# EAGLE design DriverBoard (EAGLE 9.6.2)
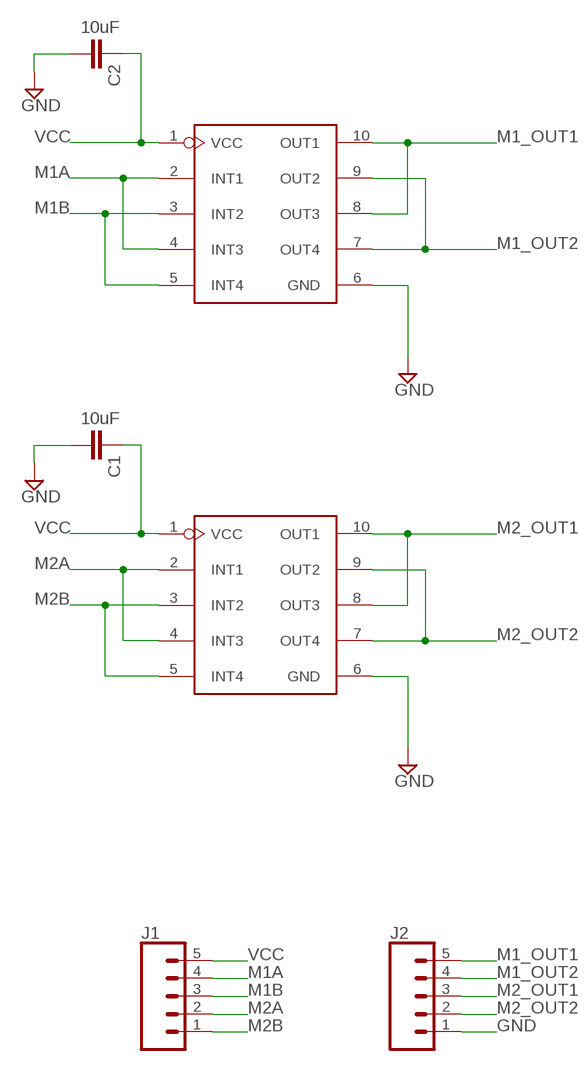
[diagram p0: schematic, sheet 1]

## Parts
C1  10uF  C-EUC0805  [C0805]
C2  10uF  C-EUC0805  [C0805]
J1  CONN_05  [1X05]
J2  CONN_05  [1X05]
U1  DRIVER-LV8548MC-AH(SOIC10)  [SOIC10-1.0-5X4MM]
U2  DRIVER-LV8548MC-AH(SOIC10)  [SOIC10-1.0-5X4MM]

## Nets
GND: C1.2 C2.2 J2.1 U1.6(GND) U2.6(GND)
M1_OUT1 [Out]: J2.5 U2.8(OUT3) U2.10(OUT1)
M1_OUT2 [Out]: J2.4 U2.7(OUT4) U2.9(OUT2)
M1A: J1.4 U2.2(INT1) U2.4(INT3)
M1B: J1.3 U2.3(INT2) U2.5(INT4)
M2_OUT1 [Out]: J2.3 U1.8(OUT3) U1.10(OUT1)
M2_OUT2 [Out]: J2.2 U1.7(OUT4) U1.9(OUT2)
M2A: J1.2 U1.2(INT1) U1.4(INT3)
M2B: J1.1 U1.3(INT2) U1.5(INT4)
VCC [Power]: C1.1 C2.1 J1.5 U1.1(VCC) U2.1(VCC)

## Library data of the parts
C1 C2 = rcl:C-EU: CAPACITOR, European symbol; SPICEPREFIX: C
J1 J2 = SparkFun-Connectors:CONN_05: Multi connection point. Often used as Generic Header-pin footprint for 0.1 inch spaced/style header connections On any of the 0.1 inch spaced packages, you can populate with these: Break Away Headers - Straight <https://www.sparkfun.com/products/116> (PRT-00116) Break Away Male Headers - Right Angle <https://www.sparkfun.com/products/553> (PRT-00553) Female Headers <https://www.sparkfun.com/products/115> (PRT-00115) Break Away Headers - Machine Pin <https://www.sparkfun.com/products/117> (PRT-00117) Break Away Female Headers - Swiss Machine Pin <https://www.sparkfun.com/products/743> (PRT-00743) For SCREWTERMINALS and SPRING TERMINALS visit here: Screw Terimnals on SparkFun.com <https://www.sparkfun.com/search/results?term=Screw+Terminals> (5mm/3.5mm/2.54mm spacing) This device is also useful as a general connection point to wire up your design to another part of your project. Our various solder wires solder well into these plated through hole pads. Hook-Up Wire - Assortment (Stranded, 22 AWG) <https://www.sparkfun.com/products/11375> (PRT-11375) Hook-Up Wire - Assortment (Solid Core, 22 AWG) <https://www.sparkfun.com/products/11367> (PRT-11367) View the entire wire category on our website here <https://www.sparkfun.com/categories/141> Special notes: Molex polarized connector foot print use with SKU : PRT-08231 with associated crimp pins and housings. 1MM SMD Version SKU: PRT-10208
U1 U2 = DRIVER-LV8548MC-AH_SOIC10_:DRIVER-LV8548MC-AH(SOIC10): 310030259 Check prices <https://pricing.snapeda.com/parts/LV8548MC-AH/ON%20Semiconductor/view-part?ref=eda>; AVAILABILITY: Warning; DESCRIPTION: Half Bridge (4) Driver DC Motors, General Purpose, Stepper Motors DMOS 10-SOIC; MF: ON Semiconductor; MP: LV8548MC-AH; PACKAGE: SOIC NB-10 ON Semiconductor; PRICE: None; PURCHASE-URL: https://pricing.snapeda.com/search/part/LV8548MC-AH/?ref=eda

## Net classes
0 default: width 0.254 mm, drill 0.3 mm, clearance 0.15 mm
1 Power: width 0.635 mm, drill 0.3 mm, clearance 0.2 mm
2 Out: width 0.508 mm, drill 0.3 mm, clearance 0.15 mm

## Board
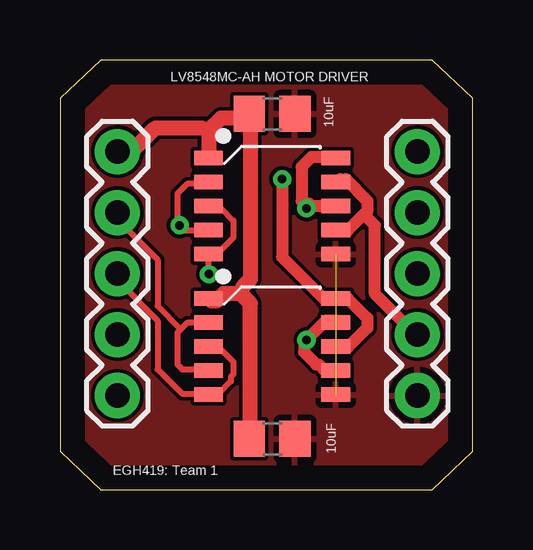
[diagram p1: board, top side]
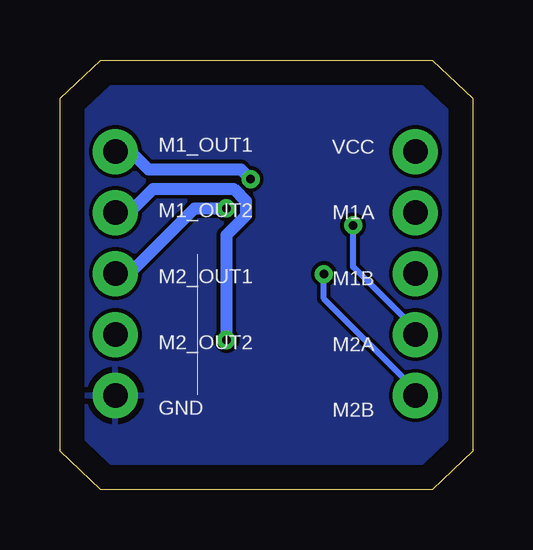
[diagram p2: board, bottom side, seen from below]

Size 17.2 x 17.9 mm. Coordinates in mm from the lower left corner, seen from the top.
Outline: 0,16.3 0,1.6 1.7,0 15.5,0 17.2,1.6 17.2,16.3 15.5,17.9 1.7,17.9 0,16.3
Copper layers (1*16): Top 0.035mm / dielectric 1.5mm / Bottom 0.035mm
Design rules "default": minimum track width 6mil, minimum drill 0.35mm, track to track 6mil, track to pad 6mil, pad to pad 6mil, via to via 6mil, smd to smd 6mil, copper to edge 40mil, drill to drill 6mil, minimum pad ring 10mil, minimum via ring 8mil, stop-mask expansion 4mil, vias tented up to drill 0mil, thermal gap 10mil

### Footprints (pad centres in the part's own frame; a part is rotated, then mirrored left to right if it is on the bottom)
C0805 = smd 1.3 x 1.5: 1 -0.95,0; 2 0.95,0
1X05 = drill 1.016 pad 1.88: 1 0,0; 2 2.54,0; 3 5.08,0; 4 7.62,0; 5 10.16,0
SOIC10-1.0-5X4MM = smd 0.6 x 1.2: 1 -2,-2.65; 2 -1,-2.65; 3 0,-2.65; 4 1,-2.65; 5 2,-2.65; 6 2,2.65; 7 1,2.65; 8 0,2.65; 9 -1,2.65; 10 -2,2.65

### Placement (x,y rotation side)
C1  8.84,15.65 0 top
C2  8.84,2.11 0 top
J1  2.39,3.92 90 top
J2  14.89,3.92 90 top
U1  8.84,11.81 270 top
U2  8.84,5.96 270 top

### Tracks (layer width: path | path; a pad name or v marks a point on that pad's centre or on a via)
GND  (1 unrouted)
  pour Bottom: -7.2,15.8 -2.8,20.2 -1.9,20.2 18.5,20.2 21.9,16.8 21.9,1 17.5,-3.4 -1.1,-3.4 -5.9,1.4 -7.2,2.7
  pour Top: -8,14.4 -1.7,20.7 16.9,20.7 25,12.6 25,2.2 18.5,-4.3 7.6,-4.3 2.2,-4.3 -9.1,7 -9.1,13.3
M1_OUT1  (via drill 0.35)
  Top 0.508: U2.8 11.59,5.93 12,5.93 12.81,6.74 12.81,7.15 12,7.96 U2.10 10.98,7.96 9.25,9.69 v9.25,12.94
  Bottom 0.508: v9.25,12.94 9.66,13.35 13.52,13.35 14.23,14.06 14.84,14.06 J2.5
M1_OUT2  (via drill 0.35)
  Top 0.508: U2.7 11.49,5.01 10.98,5.01 10.78,5.22 10.68,5.22 10.17,5.72 10.17,6.13 v10.27,6.23 11.08,7.05 11.49,7.05 U2.9
  Bottom 0.508: v10.27,6.23 10.27,10.6 9.46,11.41 9.46,12.02 9.97,12.53 13.32,12.53 14.23,11.62 14.84,11.62 J2.4
M1A
  Top 0.254: 5.04,6.69 5.29,6.94 6.11,6.94 U2.2 | 5.04,6.69 4.89,6.54 4.89,5.22 5.09,5.01 6.11,5.01 U2.4 | 5.04,6.69 4.07,7.65 4.07,9.59 2.45,11.21 2.45,11.52 J1.4
M1B
  Top 0.254: U2.3 6.21,5.93 6.61,5.93 7.22,5.32 7.22,4.81 7.12,4.71 7.12,4.51 6.61,4 6.21,4 U2.5 6.11,4 5.09,4 4.07,5.01 4.07,7.05 2.45,8.67 2.45,8.98 J1.3
M2_OUT1  (via drill 0.35)
  Top 0.508: 10.47,11.82 U1.8 | 10.47,11.82 10.37,11.92 10.17,11.92 10.07,12.02 10.07,13.45 10.47,13.85 11.49,13.85 U1.10 | v10.27,11.72 10.47,11.82
  Bottom 0.508: v10.27,11.72 11.59,11.72 14.23,9.08 14.84,9.08 J2.3
M2_OUT2
  Top 0.508: 12.66,11.46 12.81,11.62 12.81,12.02 11.9,12.94 11.69,12.94 11.59,12.84 U1.9 | 12.66,11.46 12,10.8 11.59,10.8 U1.7 | 12.66,11.46 13.12,11.01 13.12,8.16 14.84,6.44 J2.2
M2A  (via drill 0.35)
  Top 0.254: U1.4 6.11,10.8 5.19,10.8 v4.99,11.01 4.89,11.11 4.89,12.33 5.29,12.74 6.11,12.74 U1.2
  Bottom 0.254: v4.99,11.01 4.99,9.28 2.45,6.74 2.45,6.54 J1.2
M2B  (via drill 0.35)
  Top 0.254: U1.3 6.21,11.72 6.71,11.72 7.22,11.21 7.22,10.5 6.61,9.89 6.21,9.89 U1.5 6.21,9.69 v6.21,8.98
  Bottom 0.254: v6.21,8.98 6.21,7.96 2.45,4.2 2.45,4 J1.1
VCC
  Top 0.635: 7.53,8.16 6.82,8.16 6.51,7.86 6.31,7.86 6.21,7.96 U2.1 | 7.53,8.16 7.93,7.76 7.93,2.17 C2.1 | 6.21,14.97 6.21,13.85 U1.1 | 6.21,14.97 6.71,15.48 7.73,15.48 7.83,15.58 C1.1 8.04,15.38 8.04,15.28 7.93,15.17 7.93,8.77 7.63,8.47 7.53,8.16 | 6.21,14.97 5.9,15.07 3.97,15.07 3.06,14.16 2.45,14.16 J1.5

### Text on the board
tNames: LV8548MC-AH MOTOR DRIVER | 10uF | EGH419: Team 1 | 10uF
bNames: VCC / / / M1A / / / M1B / / / M2A / / / M2B | M1_OUT1 / / / M1_OUT2 / / / M2_OUT1 / / / M2_OUT2 / / / GND
200bmp: C:/Users/CodyS/OneDrive - Queensland University of Technology/Uni Coursework/2021/EGH419 Group 1 Shared Folder/Git Stuff/EGH419/LOGO.bmp